# Altium project FireFlow.PrjPCB
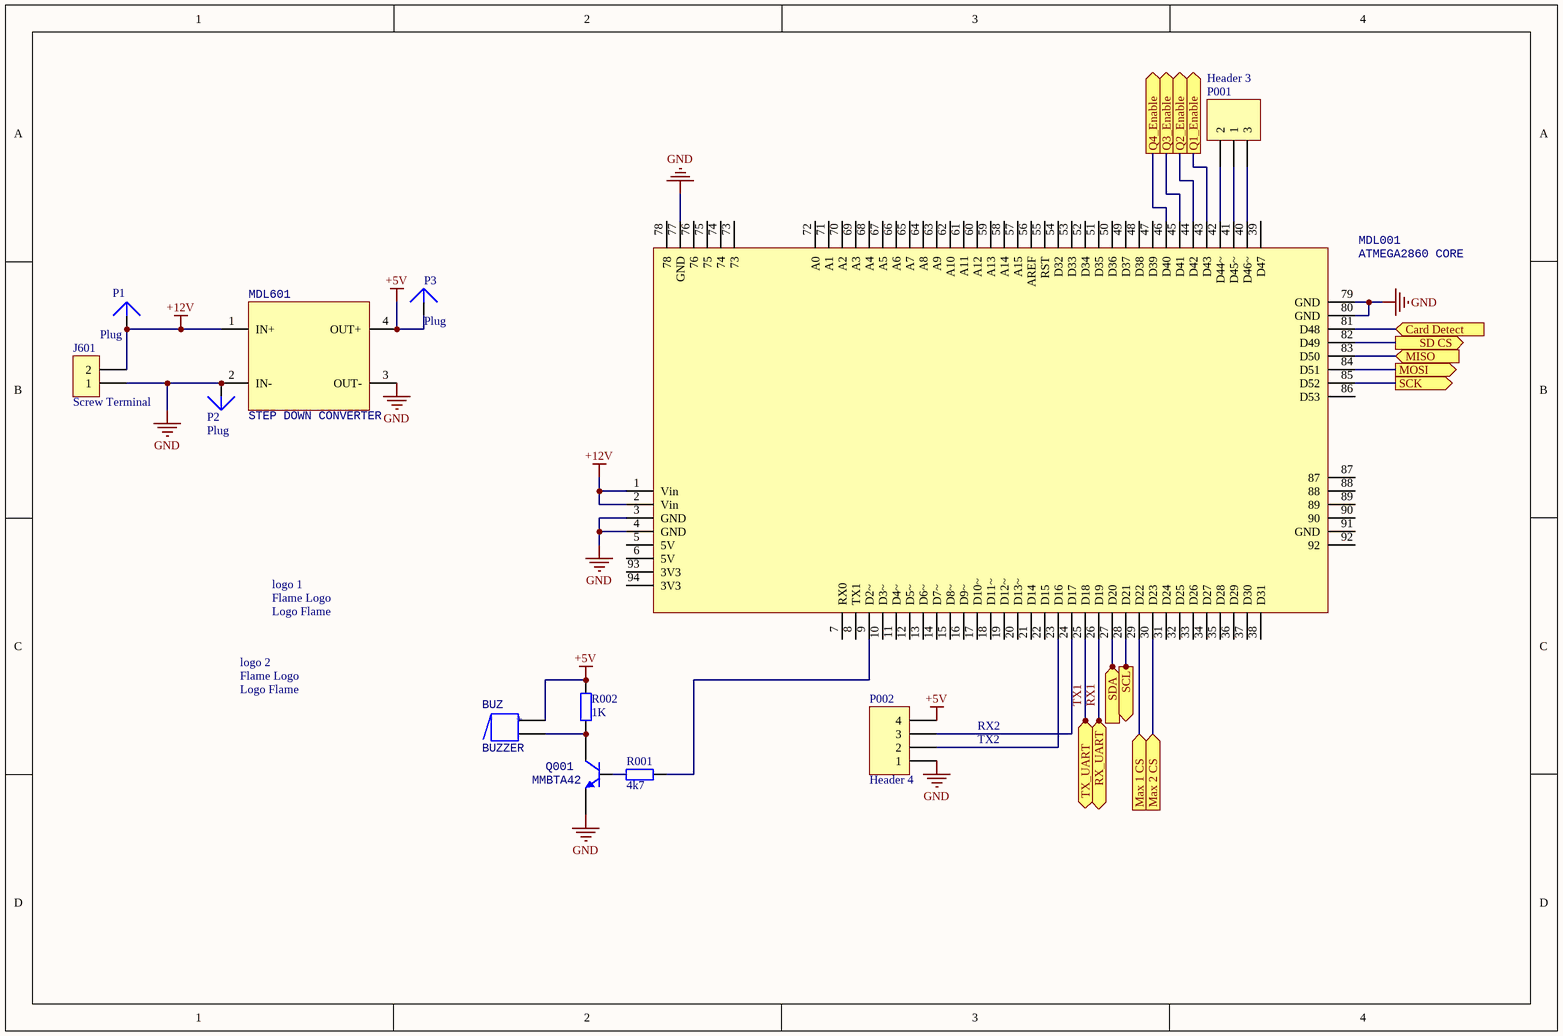
[diagram p0: FireFlow.SchDoc]
6 sheets, 112 parts. Net scope: flat (ports and power ports of the same name join across sheets).
Board file: FireFlow.PcbDoc
Sheets:
  FireFlow.SchDoc
  Relays.SchDoc
  SDcard.SchDoc
  Isolated UART-USB.SchDoc
  Max31855.SchDoc
  DS3231.SchDoc

## Sheet FireFlow.SchDoc
size A4; Organization: Altium Limited; Address1: L3, 12a Rodborough Rd; Address2: Frenchs Forest; Address3: NSW; Address4: Australia 2086

### Parts
BUZ  BUZZER  [BUZZER]
J601  Screw Terminal  [2pin ST]
logo_1  Logo Flame  [LogoF Top OL]
logo_2  Logo Flame  [LogoF Top OL]
MDL001  ATMEGA2860 CORE  [ATMEGA 2560 CORE]
MDL601  STEP DOWN CONVERTER  [STEP DOWN CONVERTER MINI]
P1  Plug  [PIN1]
P001  Header 3  [HDR1X3]
P2  Plug  [PIN1]
P002  Header 4  [HDR1X4]
P3  Plug  [PIN1]
Q001  MMBTA42  [SO-G3]
R001  4k7  [CR2012-0805]
R002  1K  [CR2012-0805]

### Ports
Card Detect (in), Max 1 CS (in), Max 2 CS (in), MISO (in), MOSI (out), Q1_Enable (out), Q2_Enable (out), Q3_Enable (out), Q4_Enable (out), RX_UART, SCK (out), SCL (out), SD CS (out), SDA (in), TX_UART

### Nets
+5V: BUZ.1 MDL601.4(OUT+) P002.4 P3.1 R002.1
+12V: J601.2 MDL001.1(Vin) MDL001.2(Vin) MDL601.1(IN+) P1.1
GND: J601.1 MDL001.3(GND) MDL001.4(GND) MDL001.77(GND) MDL001.79(GND) MDL001.80(GND) MDL601.2(IN-) MDL601.3(OUT-) P2.1 P002.1 Q001.2(E)
RX1: MDL001.26(D19) ; port RX_UART
SCL: MDL001.28(D21) ; port SCL
SD CS: MDL001.82(D49) ; port SD CS
SD_CD: MDL001.81(D48) ; port Card Detect
SD_MISO: MDL001.83(D50) ; port MISO
SD_MOSI: MDL001.84(D51) ; port MOSI
SD_SCK: MDL001.85(D52) ; port SCK
SDA: MDL001.27(D20) ; port SDA
TX1: MDL001.25(D18) ; port TX_UART
NetBUZ_2: BUZ.2 Q001.3(C) R002.2
NetD101_K: MDL001.29(D22) ; port Max 1 CS
NetD121_K: MDL001.30(D23) ; port Max 2 CS
NetMDL001_9: MDL001.9(D2~) R001.1
NetMDL001_23: MDL001.23(D16) P002.2
NetMDL001_24: MDL001.24(D17) P002.3
NetMDL001_40: MDL001.40(D46~) P001.3
NetMDL001_41: MDL001.41(D45~) P001.1
NetMDL001_42: MDL001.42(D44~) P001.2
NetMDL001_43: MDL001.43(D43) ; port Q1_Enable
NetMDL001_44: MDL001.44(D42) ; port Q2_Enable
NetMDL001_45: MDL001.45(D41) ; port Q3_Enable
NetMDL001_46: MDL001.46(D40) ; port Q4_Enable
NetQ001_1: Q001.1(B) R001.2

Not connected (* = marked no-connect by the designer): MDL001 5(5V) 6(5V) 7(RX0) 8(TX1) 10(D3~) 11(D4~) 12(D5~) 13(D6~) 14(D7~) 15(D8~) 16(D9~) 17(D10~) 18(D11~) 19(D12~) 20(D13~) 21(D14) 22(D15) 31(D24) 32(D25) 33(D26) 34(D27) 35(D28) 36(D29) 37(D30) 38(D31) 39(D47) 47(D39) 48(D38) 49(D37) 50(D36) 51(D35) 52(D34) 53(D33) 54(D32) 55(RST) 56(AREF) 57(A15) 58(A14) 59(A13) 60(A12) 61(A11) 62(A10) 63(A9) 64(A8) 65(A7) 66(A6) 67(A5) 68(A4) 69(A3) 70(A2) 71(A1) 72(A0) 73 74 75 76 78 86(D53) 87 88 89 90 91(GND) 92 93(3V3) 94(3V3)

### Notes on the sheet
- RX2
- TX2
- (in symbol BUZZER) +
- (in symbol Logo Flame) Flame Logo

### Library data of the parts
J601 = 2 pin Screw Terminal: WR-TBL Terminal block - serie 102 - 5.0mm; ComponentLink2 Description: Datasheet; NoPins: 2; ComponentLink2URL: http://katalog.we-online.de/em/datasheet/6911027100xx.pdf
MDL001 = ATMEGA2560 CORE
P001 = Header 3: Header, 3-Pin; LatestRevisionDate: 17-Jul-2002; LatestRevisionNote: Re-released for DXP Platform.; Publisher: Altium Limited
P002 = Header 4: Header, 4-Pin; LatestRevisionDate: 17-Jul-2002; LatestRevisionNote: Re-released for DXP Platform.; Publisher: Altium Limited
Q001 = MMBTA42: NPN Bipolar Transistor; Published: 8-Jun-2000; LatestRevisionDate: 17-Jul-2002; LatestRevisionNote: Re-released for DXP Platform.; PackageReference: TO-226; Publisher: Altium Limited; Code_JEDEC: TO-226-AA
R001 R002 = Resistor
  R001: Value: 4k7
  R002: Value: 1K
P1-P3 = Plug: LatestRevisionDate: 17-Jul-2002; LatestRevisionNote: Re-released for DXP Platform.; Publisher: Altium Limited

## Sheet Relays.SchDoc
size A4
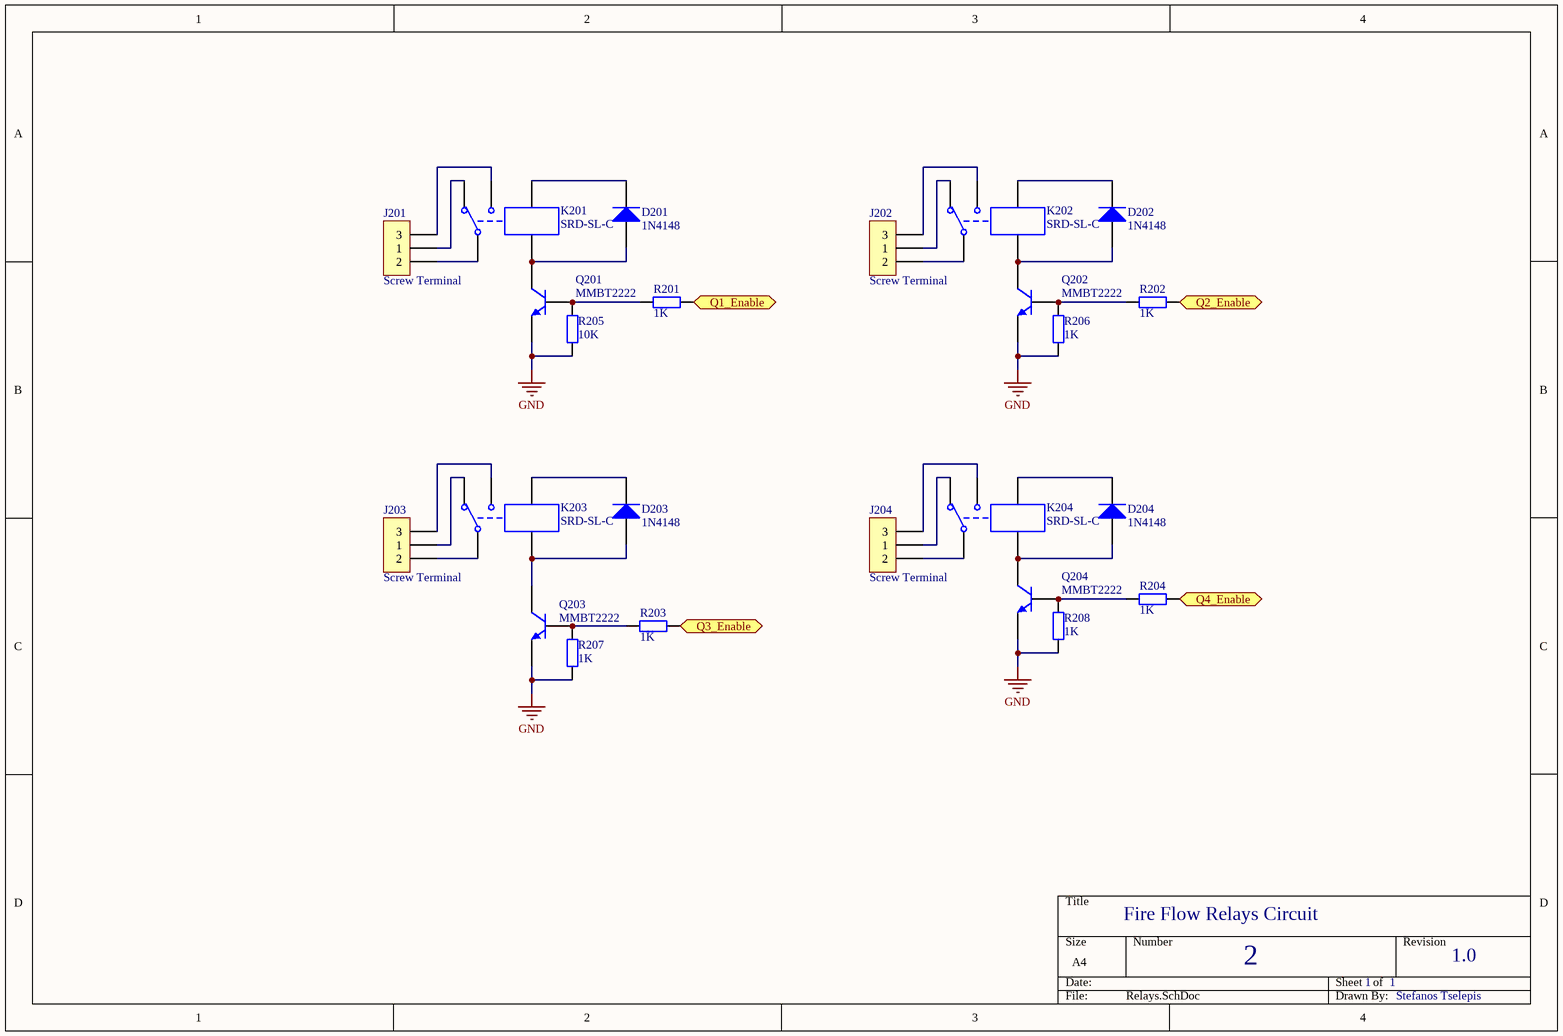
[diagram p1: Relays.SchDoc]

### Parts
D201  1N4148  [CD2012-0805]
D202  1N4148  [CD2012-0805]
D203  1N4148  [CD2012-0805]
D204  1N4148  [CD2012-0805]
J201  Screw Terminal  [3pin ST]
J202  Screw Terminal  [3pin ST]
J203  Screw Terminal  [3pin ST]
J204  Screw Terminal  [3pin ST]
K201  SRD-SL-C  [SRD-SL-C]
K202  SRD-SL-C  [SRD-SL-C]
K203  SRD-SL-C  [SRD-SL-C]
K204  SRD-SL-C  [SRD-SL-C]
Q201  MMBT2222  [SO-G3]
Q202  MMBT2222  [SO-G3]
Q203  MMBT2222  [SO-G3]
Q204  MMBT2222  [SO-G3]
R201  1K  [CR2012-0805]
R202  1K  [CR2012-0805]
R203  1K  [CR2012-0805]
R204  1K  [CR2012-0805]
R205  10K  [CR2012-0805]
R206  1K  [CR2012-0805]
R207  1K  [CR2012-0805]
R208  1K  [CR2012-0805]

### Ports
Q1_Enable (in), Q2_Enable (in), Q3_Enable (in), Q4_Enable (in)

### Nets
GND: Q201.2(E) Q202.2(E) Q203.2(E) Q204.2(E) R205.1 R206.1 R207.1 R208.1
NetD201_A: D201.A K201.2 Q201.3(C)
NetD201_K: D201.K K201.1
NetD202_A: D202.A K202.2 Q202.3(C)
NetD202_K: D202.K K202.1
NetD203_A: D203.A K203.2 Q203.3(C)
NetD203_K: D203.K K203.1
NetD204_A: D204.A K204.2 Q204.3(C)
NetD204_K: D204.K K204.1
NetJ201_1: J201.1 K201.5
NetJ201_2: J201.2 K201.3
NetJ201_3: J201.3 K201.4
NetJ202_1: J202.1 K202.5
NetJ202_2: J202.2 K202.3
NetJ202_3: J202.3 K202.4
NetJ203_1: J203.1 K203.5
NetJ203_2: J203.2 K203.3
NetJ203_3: J203.3 K203.4
NetJ204_1: J204.1 K204.5
NetJ204_2: J204.2 K204.3
NetJ204_3: J204.3 K204.4
NetMDL001_43: R201.2 ; port Q1_Enable
NetMDL001_44: R202.2 ; port Q2_Enable
NetMDL001_45: R203.2 ; port Q3_Enable
NetMDL001_46: R204.2 ; port Q4_Enable
NetQ201_1: Q201.1(B) R201.1 R205.2
NetQ202_1: Q202.1(B) R202.1 R206.2
NetQ203_1: Q203.1(B) R203.1 R207.2
NetQ204_1: Q204.1(B) R204.1 R208.2

### Notes on the sheet
- Fire Flow Relays Circuit
- 2
- 1
- 1.0
- Stefanos Tselepis

### Library data of the parts
D201-D204 = Diode: Value: 1N4148
J201-J204 = 3 pin Screw Terminal: WR-TBL Terminal block - serie 102 - 5.0mm; ComponentLink2 Description: Datasheet; NoPins: 3; ComponentLink2URL: http://katalog.we-online.de/em/datasheet/6911027100xx.pdf
K201-K204 = Relay SRD-SL-C
Q201-Q204 = MMBT2222: NPN General Purpose Amplifier; Value: MMBT2222
R201-R208 = Resistor
  R201-R204 R206-R208: Value: 1K
  R205: Value: 10K

## Sheet SDcard.SchDoc
size A4
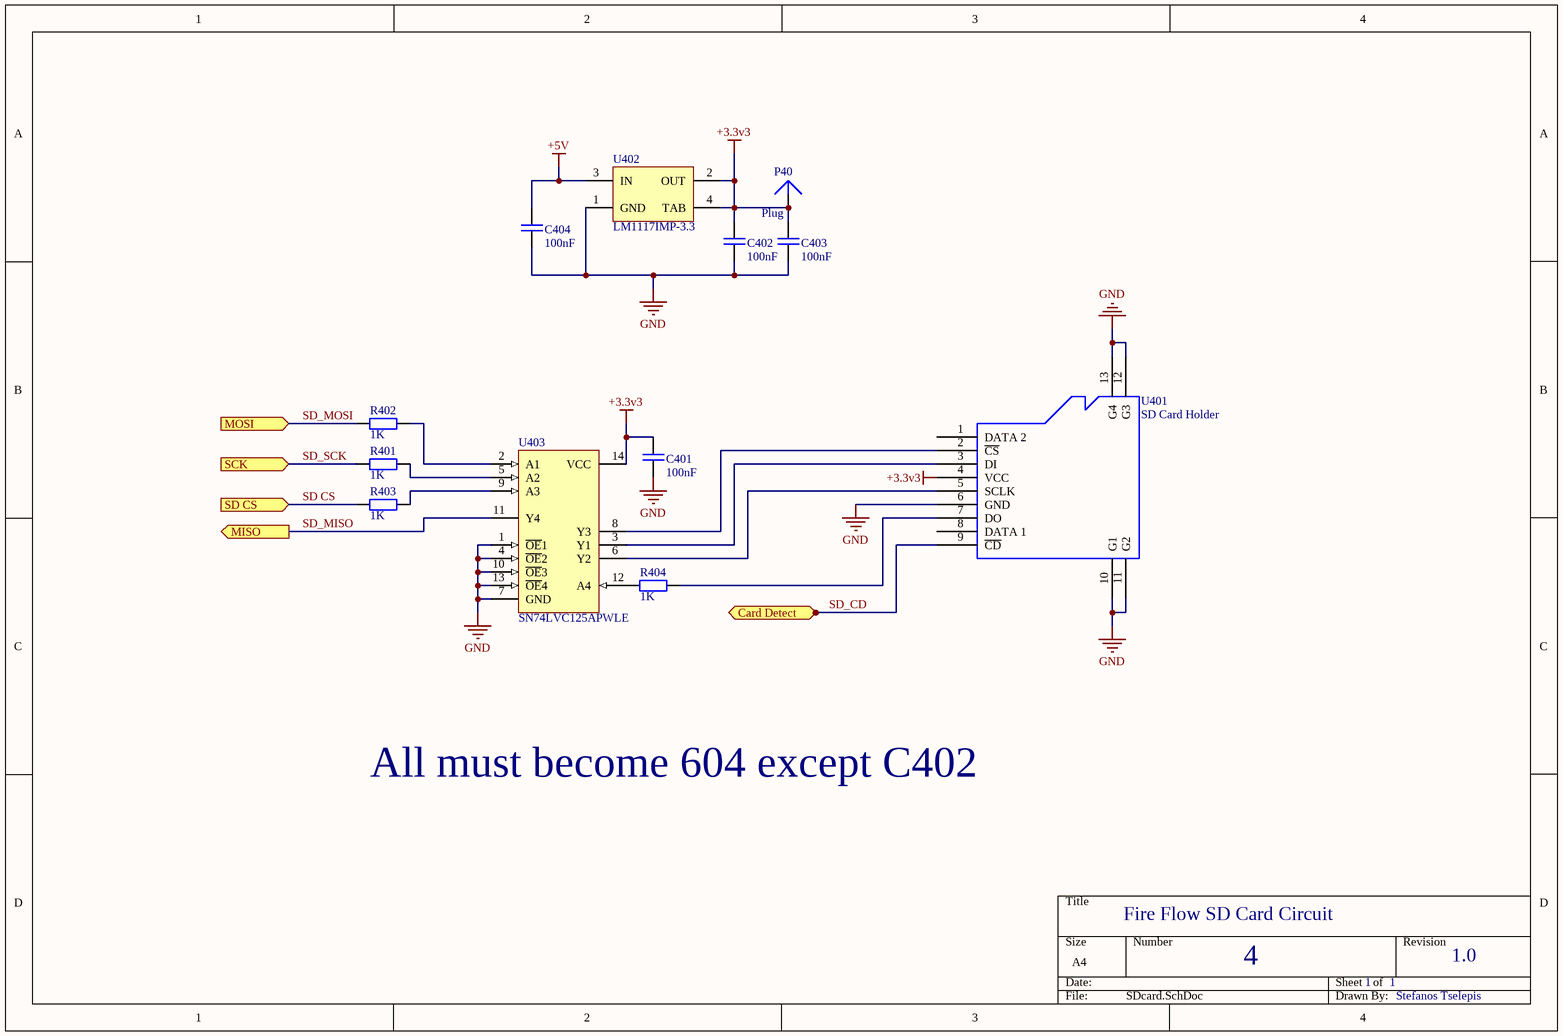
[diagram p2: SDcard.SchDoc]

### Parts
C401  100nF  [CC2013-0805]
C402  100nF  [CC2013-0805]
C403  100nF  [CC2013-0805]
C404  100nF  [CC2013-0805]
P40  Plug  [PIN1]
R401  1K  [CR2012-0805]
R402  1K  [CR2012-0805]
R403  1K  [CR2012-0805]
R404  1K  [CR2012-0805]
U401  SD Card Holder  [Micro SD Card holder]
U402  LM1117IMP-3.3  [MP04A_N]
U403  SN74LVC125APWLE  [PW014_N]

### Ports
Card Detect (out), MISO (out), MOSI (in), SCK (in), SD CS (in)

### Nets
+3.3v3: C401.1 C402.1 C403.1 P40.1 U401.4(VCC) U402.2(OUT) U402.4(TAB) U403.14(VCC)
+5V: C404.1 U402.3(IN)
GND: C401.2 C402.2 C403.2 C404.2 U401.6(GND) U401.10(G1) U401.11(G2) U401.12(G3) U401.13(G4) U402.1(GND) U403.1(~{OE}1) U403.4(~{OE}2) U403.7(GND) U403.10(~{OE}3) U403.13(~{OE}4)
SD CS: R403.2 ; port SD CS
SD_CD: U401.9(~{CD}) ; port Card Detect
SD_MISO: U403.11(Y4) ; port MISO
SD_MOSI: R402.2 ; port MOSI
SD_SCK: R401.2 ; port SCK
NetR401_1: R401.1 U403.5(A2)
NetR402_1: R402.1 U403.2(A1)
NetR403_1: R403.1 U403.9(A3)
NetR404_1: R404.1 U403.12(A4)
NetR404_2: R404.2 U401.7(DO)
NetU401_2: U401.2(~{CS}) U403.8(Y3)
NetU401_3: U401.3(DI) U403.3(Y1)
NetU401_5: U401.5(SCLK) U403.6(Y2)

Not connected (* = marked no-connect by the designer): U401 1(DATA_2) 8(DATA_1)

### Notes on the sheet
- All must become 604 except C402
- Fire Flow SD Card Circuit
- 4
- 1
- 1.0
- Stefanos Tselepis

### Library data of the parts
C401-C404 = Cap Metal Film: Value: 100nF
R401-R404 = Resistor: Value: 1K
U402 = LM1117IMP-3.3: 800mA Low-Dropout Linear Regulator, 4-pin SOT-223; Manufacturer: National Semiconductor; PackageTopMarking: XYTT*N05B; PowerWise: N; CompType: LDO IC; Published: 4-Dec-2008; DatasheetVersion: Apr-2006; PackageVersion: revB, Apr-2003; PackageReference: MP04A; Publisher: Altium Limited; PackageDescription: Molded SOT-223, 6.50 x 3.56 x 1.6mm Body, 4 Lead, 2.3mm Pitch; PartNumber: LM1117IMP-3.3; RoHS: N; PinCount: 4; Code_JEDEC: TO-261-AA; Code_IPC: SOT223-4; ComponentLink1Description: LM1117 Datasheet; ComponentLink1URL: http://www.national.com/ds/LM/LM1117.pdf; ComponentLink2Description: LM1117 Web Page; ComponentLink2URL: http://www.national.com/pf/LM/LM1117.html; ComponentLink3Description: MP04A Package Page; ComponentLink3URL: http://www.national.com/packaging/folders/mp04a.html
U403 = SN74LVC125APWLE: Quadruple Bus Buffer Gate with 3-State Outputs
P40 = Plug: LatestRevisionDate: 17-Jul-2002; LatestRevisionNote: Re-released for DXP Platform.; Publisher: Altium Limited

## Sheet Isolated UART-USB.SchDoc
size A4
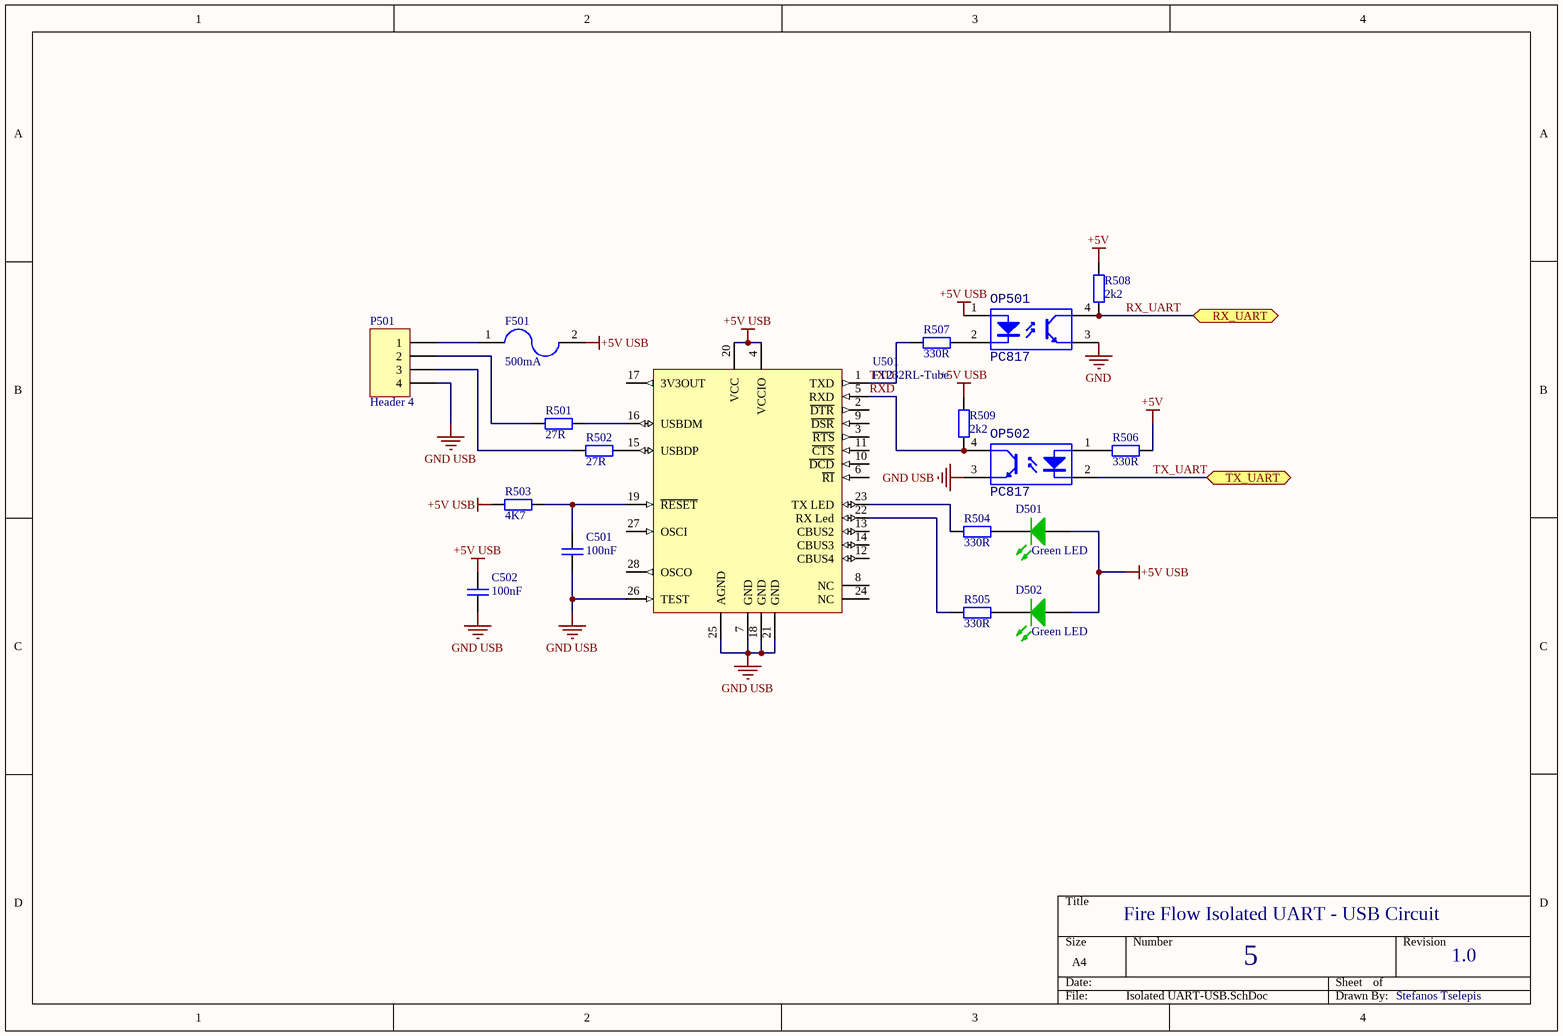
[diagram p3: Isolated UART-USB.SchDoc]

### Parts
C501  100nF  [CC2013-0805]
C502  100nF  [CC2013-0805]
D501  Green LED  [CD3216-1206]
D502  Green LED  [CD3216-1206]
F501  500mA  [CF-1812]
OP501  PC817  [DIP-4]
OP502  PC817  [DIP-4]
P501  Header 4  [HDR1X4]
R501  27R  [CR2012-0805]
R502  27R  [CR2012-0805]
R503  4K7  [CR2012-0805]
R504  330R  [CR2012-0805]
R505  330R  [CR2012-0805]
R506  330R  [CR2012-0805]
R507  330R  [CR2012-0805]
R508  2k2  [CR2012-0805]
R509  2k2  [CR2012-0805]
U501  FT232RL-Tube  [SSOP-28_N]

### Ports
RX_UART, TX_UART

### Nets
+5V: R506.2 R508.2
+5V USB: C502.1 D501.1(A) D502.1(A) F501.2 OP501.1(A) R503.1 R509.2 U501.4(VCCIO) U501.20(VCC)
GND: OP501.3(E)
GND USB: C501.2 C502.2 OP502.3(E) P501.4 U501.7(GND) U501.18(GND) U501.21(GND) U501.25(AGND) U501.26(TEST)
RX_UART: OP501.4(C) R508.1 ; port RX_UART  [project net RX1]
RXD: OP502.4(C) R509.1 U501.5(RXD)
TX_UART: OP502.2(K) ; port TX_UART  [project net TX1]
TXD: R507.1 U501.1(TXD)
NetC501_1: C501.1 R503.2 U501.19(~{RESET})
NetD501_2: D501.2(K) R504.2
NetD502_2: D502.2(K) R505.2
NetF501_1: F501.1 P501.1
NetOP501_2: OP501.2(K) R507.2
NetOP502_1: OP502.1(A) R506.1
NetP501_2: P501.2 R501.2
NetP501_3: P501.3 R502.2
NetR501_1: R501.1 U501.16(USBDM)
NetR502_1: R502.1 U501.15(USBDP)
NetR504_1: R504.1 U501.23(TX_LED)
NetR505_1: R505.1 U501.22(RX_Led)

Not connected (* = marked no-connect by the designer): U501 2(~{DTR}) 3(~{RTS}) 6(~{RI}) 8(NC) 9(~{DSR}) 10(~{DCD}) 11(~{CTS}) 12(CBUS4) 13(CBUS2) 14(CBUS3) 17(3V3OUT) 24(NC) 27(OSCI) 28(OSCO)

### Notes on the sheet
- Fire Flow Isolated UART - USB Circuit
- 5
- 1.0
- Stefanos Tselepis

### Library data of the parts
C501 C502 = Cap Metal Film: Value: 100nF
D501 D502 = LED: RED
F501 = Fuse: PPTC; Value: 500mA
OP501 OP502 = OPTO-DC: DC OPTOCUPLER
P501 = Header 4: Header, 4-Pin; LatestRevisionDate: 17-Jul-2002; LatestRevisionNote: Re-released for DXP Platform.; Publisher: Altium Limited
R501-R509 = Resistor
  R501 R502: Value: 27R
  R503: Value: 4K7
  R504-R507: Value: 330R
  R508 R509: Value: 2k2
U501 = FT232RL-Tube: USB UART Asynchronous Serial Data Transfer Chip, SSOP-28, Tube; PackageReference: SSOP-28; PackageDescription: 28-Pin Small Outline Package 0.65 mm Pitch

## Sheet Max31855.SchDoc
size A4
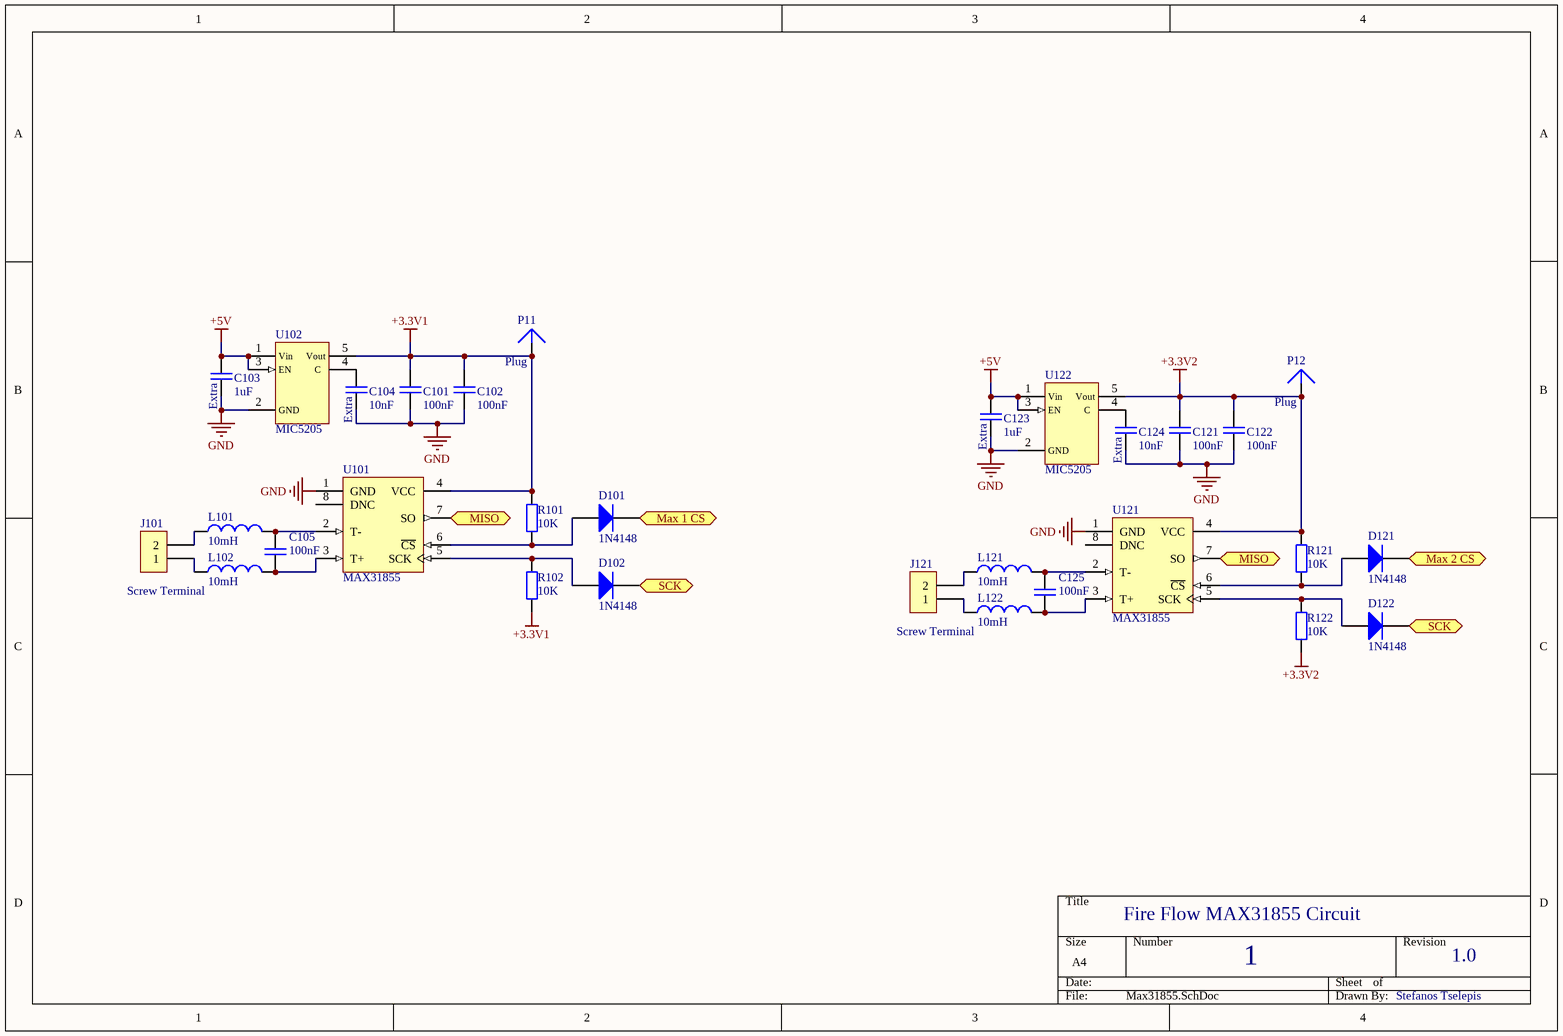
[diagram p4: Max31855.SchDoc]

### Parts
C101  100nF  [CC2013-0805]
C102  100nF  [CC2013-0805]
C103  1uF  [CC2013-0805]
C104  10nF  [CC2013-0805]
C105  100nF  [CC2013-0805]
C121  100nF  [CC2013-0805]
C122  100nF  [CC2013-0805]
C123  1uF  [CC2013-0805]
C124  10nF  [CC2013-0805]
C125  100nF  [CC2013-0805]
D101  1N4148  [CD2012-0805]
D102  1N4148  [CD2012-0805]
D121  1N4148  [CD2012-0805]
D122  1N4148  [CD2012-0805]
J101  Screw Terminal  [2pin ST]
J121  Screw Terminal  [2pin ST]
L101  10mH  [INDC2012-0805]
L102  10mH  [INDC2012-0805]
L121  10mH  [INDC2012-0805]
L122  10mH  [INDC2012-0805]
P11  Plug  [PIN1]
P12  Plug  [PIN1]
R101  10K  [CR2012-0805]
R102  10K  [CR2012-0805]
R121  10K  [CR2012-0805]
R122  10K  [CR2012-0805]
U101  MAX31855  [S8]
U102  MIC5205  [SO-G5/P.95]
U121  MAX31855  [S8]
U122  MIC5205  [SO-G5/P.95]

### Ports
Max 1 CS (in), Max 2 CS (in), MISO (out), SCK (in)

### Nets
+3.3V1: C101.1 C102.1 P11.1 R101.2 R102.1 U101.4(VCC) U102.5(Vout)
+3.3V2: C121.1 C122.1 P12.1 R121.2 R122.1 U121.4(VCC) U122.5(Vout)
+5V: C103.1 C123.1 U102.1(Vin) U102.3(EN) U122.1(Vin) U122.3(EN)
GND: C101.2 C102.2 C103.2 C104.2 C121.2 C122.2 C123.2 C124.2 U101.1(GND) U102.2(GND) U121.1(GND) U122.2(GND)
SD_MISO: U101.7(SO) U121.7(SO) ; port MISO
SD_SCK: D102.K D122.K ; port SCK
NetC104_1: C104.1 U102.4(C)
NetC105_1: C105.1 L101.2 U101.2(T-)
NetC105_2: C105.2 L102.2 U101.3(T+)
NetC124_1: C124.1 U122.4(C)
NetC125_1: C125.1 L121.2 U121.2(T-)
NetC125_2: C125.2 L122.2 U121.3(T+)
NetD101_A: D101.A R101.1 U101.6(~{CS})
NetD101_K: D101.K ; port Max 1 CS
NetD102_A: D102.A R102.2 U101.5(SCK)
NetD121_A: D121.A R121.1 U121.6(~{CS})
NetD121_K: D121.K ; port Max 2 CS
NetD122_A: D122.A R122.2 U121.5(SCK)
NetJ101_1: J101.1 L102.1
NetJ101_2: J101.2 L101.1
NetJ121_1: J121.1 L122.1
NetJ121_2: J121.2 L121.1

Not connected (* = marked no-connect by the designer): U101 8(DNC); U121 8(DNC)

### Notes on the sheet
- (near C103) Extra
- (near C104) Extra
- (near C123) Extra
- (near C124) Extra
- Fire Flow MAX31855 Circuit
- 1
- 1.0
- Stefanos Tselepis

### Library data of the parts
C101-C105 C121-C125 = Cap Metal Film
  C101 C102 C105 C121 C122 C125: Value: 100nF
  C103 C123: Value: 1uF
  C104 C124: Value: 10nF
D101 D102 D121 D122 = Diode: Value: 1N4148
J101 J121 = 2 pin Screw Terminal: as J601 on sheet FireFlow; ComponentLink2URL: http://katalog.we-online.de/em/datasheet/6911027100xx.pdf
L101 L102 L121 L122 = Inductor: Value: 10mH
R101 R102 R121 R122 = Resistor: Value: 10K
U101 U121 = MAX31855: Cold Junction Compensated Thermocouple to Digital Converter, 14 Bits Temperature Resolution, -40 to 125 degC, 8-Pin SOIC (S8+4), Pb-Free, Tape ang Reel; Functions: Thermocouple-to-Digital Converter; Interface: SPI; PackageReference: S8+4; PackageDescription: 8-Pin Small-Outline IC, Narrow, Body 3.9 x 4.9 mm, Pitch 1.27 mm; Generic Part Number: MAX31855; Mounting Technology: Surface Mount
P11 P12 = Plug: LatestRevisionDate: 17-Jul-2002; LatestRevisionNote: Re-released for DXP Platform.; Publisher: Altium Limited

## Sheet DS3231.SchDoc
size A4
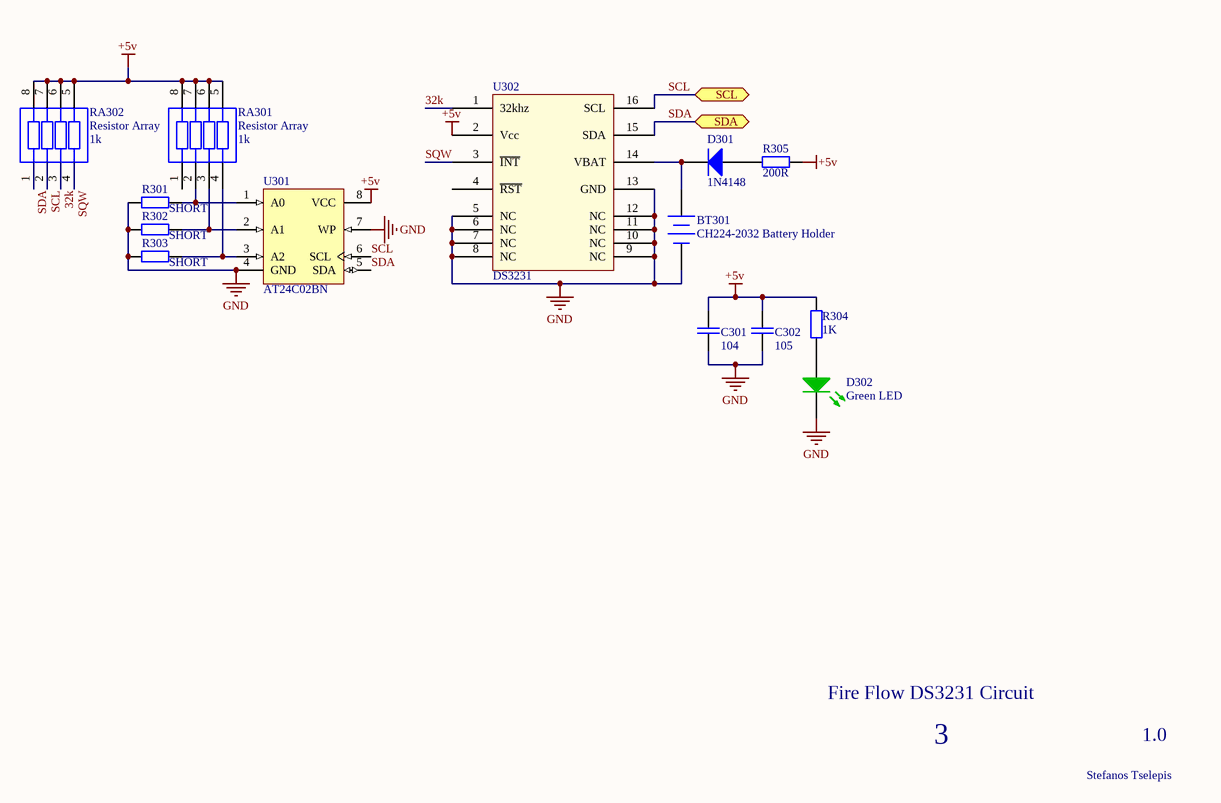
[diagram p5: DS3231.SchDoc]

### Parts
BT301  CH224-2032 Battery Holder  [CH224-2032 Battery Holder]
C301  104  [CC2013-0805]
C302  105  [CC2013-0805]
D301  1N4148  [CD2012-0805]
D302  Green LED  [CD3216-1206]
R301  SHORT  [CR2012-0805]
R302  SHORT  [CR2012-0805]
R303  SHORT  [CR2012-0805]
R304  1K  [CR2012-0805]
R305  200R  [CR2012-0805]
RA301  Resistor Array  value 1k  [EXB38V]
RA302  Resistor Array  value 1k  [EXB38V]
U301  AT24C02BN  [S8]
U302  DS3231  [SO-G16/D10.4]

### Ports
SCL, SDA

### Nets
+5V: C301.1 C302.1 R304.1 R305.2 RA301.5 RA301.6 RA301.7 RA301.8 RA302.5 RA302.6 RA302.7 RA302.8 U301.8(VCC) U302.2(Vcc)
GND: BT301.2(-) C301.2 C302.2 D302.2(K) R301.2 R302.2 R303.2 U301.4(GND) U301.7(WP) U302.5(NC) U302.6(NC) U302.7(NC) U302.8(NC) U302.9(NC) U302.10(NC) U302.11(NC) U302.12(NC) U302.13(GND)
32k: RA302.3 U302.1(32khz)
SCL: RA302.2 U301.6(SCL) U302.16(SCL) ; port SCL
SDA: RA302.1 U301.5(SDA) U302.15(SDA) ; port SDA
SQW: RA302.4 U302.3(~{INT})
NetBT301_1: BT301.1(+) D301.K U302.14(VBAT)
NetD301_A: D301.A R305.1
NetD302_1: D302.1(A) R304.2
NetR301_1: R301.1 RA301.2 U301.1(A0)
NetR302_1: R302.1 RA301.3 U301.2(A1)
NetR303_1: R303.1 RA301.4 U301.3(A2)

Not connected (* = marked no-connect by the designer): RA301 1; U302 4(~{RST})

### Notes on the sheet
- Fire Flow DS3231 Circuit
- 3
- 1.0
- Stefanos Tselepis

### Library data of the parts
BT301 = Battery: Multicell Battery
C301 C302 = Cap Metal Film
  C301: Value: 104
  C302: Value: 105
D301 = Diode: Value: 1N4148
D302 = LED: RED
R301-R305 = Resistor
  R301-R303: Value: SHORT
  R304: Value: 1K
  R305: Value: 200R
U301 = AT24C02BN-SP25-B: 2Kbit (256 x 8), 2-wire Bus Automotive Serial EEPROM with full memory Write Protect, 2.5V, 8-Pin SOIC, Bulk; Published: 20-Sep-2010; DatasheetVersion: 8517C,  Jan-2009; PackageVersion: revC, Mar-2005; PackageReference: 8S1; Publisher: Altium Limited; PackageDescription: 8-Lead (0.150" Wide Body), Plastic Gull Wing Small Outline (JEDEC SOIC); Code_JEDEC: MS-012-AA; Code_IPC: SOIC127P600-8; ComponentLink1Description: Manufacturer Link; ComponentLink1URL: http://www.atmel.com/products/serial/default.asp; ComponentLink2Description: Datasheet; ComponentLink2URL: http://www.atmel.com/dyn/resources/prod_documents/doc8517.pdf; ComponentLink3Description: Atmel.com Home; ComponentLink3URL: http://www.atmel.com

## Nets that join several sheets
+5V: FireFlow (5 pins), SDcard (C404.1 U402.3), Isolated UART-USB (R506.2 R508.2), Max31855 (6 pins), DS3231 (14 pins)
GND: FireFlow (11 pins), Relays (8 pins), SDcard (15 pins), Isolated UART-USB (OP501.3), Max31855 (12 pins), DS3231 (18 pins)
NetD101_K: FireFlow (MDL001.29), Max31855 (D101.K)
NetD121_K: FireFlow (MDL001.30), Max31855 (D121.K)
NetMDL001_43: FireFlow (MDL001.43), Relays (R201.2)
NetMDL001_44: FireFlow (MDL001.44), Relays (R202.2)
NetMDL001_45: FireFlow (MDL001.45), Relays (R203.2)
NetMDL001_46: FireFlow (MDL001.46), Relays (R204.2)
RX1: FireFlow (MDL001.26), Isolated UART-USB (OP501.4 R508.1)
SCL: FireFlow (MDL001.28), DS3231 (RA302.2 U301.6 U302.16)
SD CS: FireFlow (MDL001.82), SDcard (R403.2)
SD_CD: FireFlow (MDL001.81), SDcard (U401.9)
SD_MISO: FireFlow (MDL001.83), SDcard (U403.11), Max31855 (U101.7 U121.7)
SD_MOSI: FireFlow (MDL001.84), SDcard (R402.2)
SD_SCK: FireFlow (MDL001.85), SDcard (R401.2), Max31855 (D102.K D122.K)
SDA: FireFlow (MDL001.27), DS3231 (RA302.1 U301.5 U302.15)
TX1: FireFlow (MDL001.25), Isolated UART-USB (OP502.2)